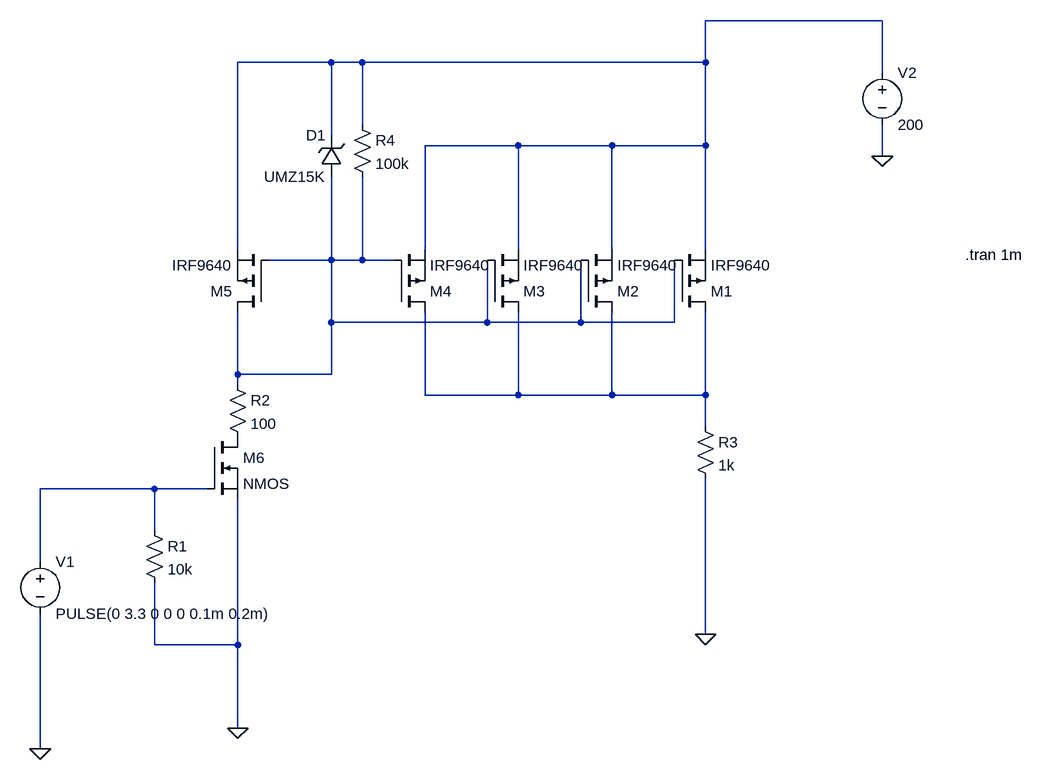
[diagram p0: schematic stim_controller_v7.3.asc]
stim_controller_v7.3.asc, the LTspice schematic file:
Version 4
SHEET 1 1580 840
WIRE 1328 -464 1056 -464
WIRE 480 -400 336 -400
WIRE 528 -400 480 -400
WIRE 1056 -400 1056 -464
WIRE 1056 -400 528 -400
WIRE 1328 -384 1328 -464
WIRE 528 -304 528 -400
WIRE 480 -288 480 -400
WIRE 768 -272 624 -272
WIRE 912 -272 768 -272
WIRE 1056 -272 1056 -400
WIRE 1056 -272 912 -272
WIRE 1328 -256 1328 -304
WIRE 336 -112 336 -400
WIRE 624 -112 624 -272
WIRE 768 -112 768 -272
WIRE 912 -112 912 -272
WIRE 1056 -112 1056 -272
WIRE 480 -96 480 -224
WIRE 480 -96 384 -96
WIRE 528 -96 528 -224
WIRE 528 -96 480 -96
WIRE 576 -96 528 -96
WIRE 480 0 480 -96
WIRE 720 0 720 -96
WIRE 720 0 480 0
WIRE 864 0 864 -96
WIRE 864 0 720 0
WIRE 1008 0 1008 -96
WIRE 1008 0 864 0
WIRE 336 80 336 -16
WIRE 480 80 480 0
WIRE 480 80 336 80
WIRE 336 96 336 80
WIRE 624 112 624 -16
WIRE 768 112 768 -16
WIRE 768 112 624 112
WIRE 912 112 912 -16
WIRE 912 112 768 112
WIRE 1056 112 1056 -16
WIRE 1056 112 912 112
WIRE 1056 160 1056 112
WIRE 208 256 32 256
WIRE 288 256 208 256
WIRE 208 320 208 256
WIRE 32 368 32 256
WIRE 1056 480 1056 240
WIRE 208 496 208 400
WIRE 336 496 336 272
WIRE 336 496 208 496
WIRE 336 624 336 496
WIRE 32 656 32 448
FLAG 32 656 0
FLAG 336 624 0
FLAG 1328 -256 0
FLAG 1056 480 0
SYMBOL voltage 32 352 R0
SYMATTR InstName V1
SYMATTR Value PULSE(0 3.3 0 0 0 0.1m 0.2m)
SYMBOL voltage 1328 -400 R0
SYMATTR InstName V2
SYMATTR Value 200
SYMBOL res 1040 144 R0
SYMATTR InstName R3
SYMATTR Value 1k
SYMBOL pmos 1008 -16 M180
SYMATTR InstName M1
SYMATTR Value IRF9640
SYMBOL pmos 864 -16 M180
SYMATTR InstName M2
SYMATTR Value IRF9640
SYMBOL pmos 720 -16 M180
SYMATTR InstName M3
SYMATTR Value IRF9640
SYMBOL pmos 576 -16 M180
SYMATTR InstName M4
SYMATTR Value IRF9640
SYMBOL pmos 384 -16 R180
SYMATTR InstName M5
SYMATTR Value IRF9640
SYMBOL nmos 288 176 R0
SYMATTR InstName M6
SYMBOL res 192 304 R0
SYMATTR InstName R1
SYMATTR Value 10k
SYMBOL zener 496 -224 R180
WINDOW 0 24 64 Left 2
WINDOW 3 24 0 Left 2
SYMATTR InstName D1
SYMATTR Value UMZ15K
SYMBOL res 320 80 R0
SYMATTR InstName R2
SYMATTR Value 100
SYMBOL res 512 -320 R0
SYMATTR InstName R4
SYMATTR Value 100k
TEXT 1456 -104 Left 2 !.tran 1m

The netlist it stands for:
* stim_controller_v7.3.asc
V1 N004 0 PULSE(0 3.3 0 0 0 0.1m 0.2m)
V2 N001 0 200
R3 N003 0 1k
M1 N003 N002 N001 N001 IRF9640
M2 N003 N002 N001 N001 IRF9640
M3 N003 N002 N001 N001 IRF9640
M4 N003 N002 N001 N001 IRF9640
M5 N002 N002 N001 N001 IRF9640
M6 P001 N004 0 0 NMOS
R1 N004 0 10k
D1 N002 N001 UMZ15K
R2 N002 P001 100
R4 N001 N002 100k
.model D D
.lib standard.dio
.model NMOS NMOS
.model PMOS PMOS
.lib standard.mos
.tran 1m
.backanno
.end